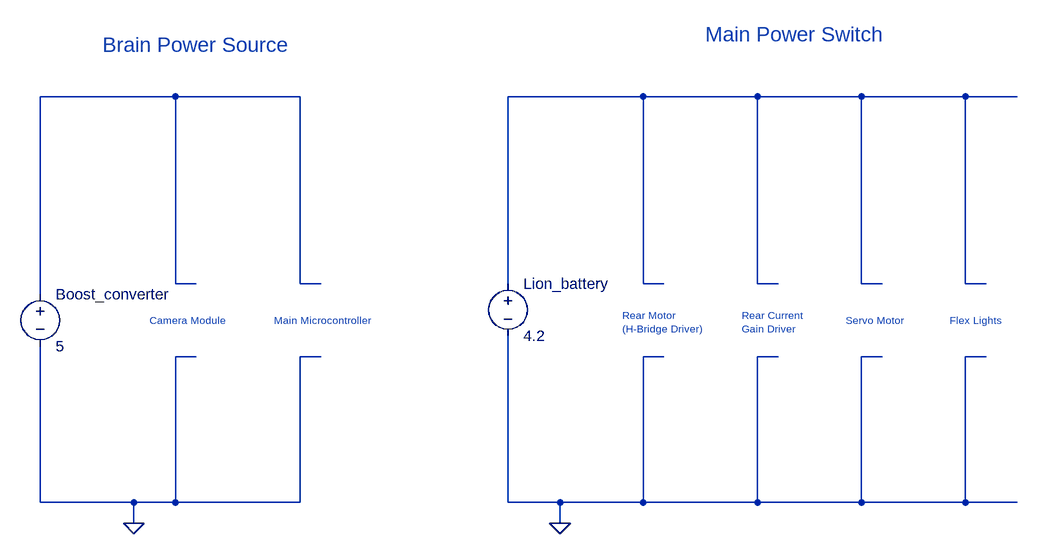
[diagram p0: schematic Power Module ( version 1 ).asc]
Power Module ( version 1 ).asc, the LTspice schematic file:
Version 4
SHEET 1 1604 680
WIRE 304 -192 96 -192
WIRE 496 -192 304 -192
WIRE 1024 -192 816 -192
WIRE 1200 -192 1024 -192
WIRE 1360 -192 1200 -192
WIRE 1520 -192 1360 -192
WIRE 1600 -192 1520 -192
WIRE 304 96 304 -192
WIRE 336 96 304 96
WIRE 496 96 496 -192
WIRE 528 96 496 96
WIRE 816 96 816 -192
WIRE 1024 96 1024 -192
WIRE 1056 96 1024 96
WIRE 1200 96 1200 -192
WIRE 1232 96 1200 96
WIRE 1360 96 1360 -192
WIRE 1392 96 1360 96
WIRE 1520 96 1520 -192
WIRE 1552 96 1520 96
WIRE 96 112 96 -192
WIRE 336 208 304 208
WIRE 528 208 496 208
WIRE 1056 208 1024 208
WIRE 1232 208 1200 208
WIRE 1392 208 1360 208
WIRE 1552 208 1520 208
WIRE 96 432 96 192
WIRE 240 432 96 432
WIRE 304 432 304 208
WIRE 304 432 240 432
WIRE 496 432 496 208
WIRE 496 432 304 432
WIRE 816 432 816 176
WIRE 896 432 816 432
WIRE 1024 432 1024 208
WIRE 1024 432 896 432
WIRE 1200 432 1200 208
WIRE 1200 432 1024 432
WIRE 1360 432 1360 208
WIRE 1360 432 1200 432
WIRE 1520 432 1520 208
WIRE 1520 432 1360 432
WIRE 1600 432 1520 432
WIRE 240 464 240 432
WIRE 896 464 896 432
FLAG 240 464 0
FLAG 896 464 0
SYMBOL voltage 96 96 R0
SYMATTR InstName Boost_converter
SYMATTR Value 5
SYMBOL voltage 816 80 R0
SYMATTR InstName Lion_battery
SYMATTR Value 4.2
TEXT 264 152 Left 1 ;Camera Module
TEXT 456 152 Left 1 ;Main Microcontroller
TEXT 192 -272 Left 3 ;Brain Power Source
TEXT 992 144 Left 1 ;Rear Motor\n(H-Bridge Driver)
TEXT 1176 144 Left 1 ;Rear Current\nGain Driver
TEXT 1336 152 Left 1 ;Servo Motor
TEXT 1496 152 Left 1 ;Flex Lights
TEXT 1120 -288 Left 3 ;Main Power Switch

The netlist it stands for:
* Power Module ( version 1 ).asc
V§Boost_converter N001 0 5
V§Lion_battery N002 0 4.2
* Camera Module
* Main Microcontroller
* Brain Power Source
* Rear Motor
* (H-Bridge Driver)
* Rear Current
* Gain Driver
* Servo Motor
* Flex Lights
* Main Power Switch
.backanno
.end